# EAGLE design wifi-leds (EAGLE 9.3.1)

## Sheet 1 of 5
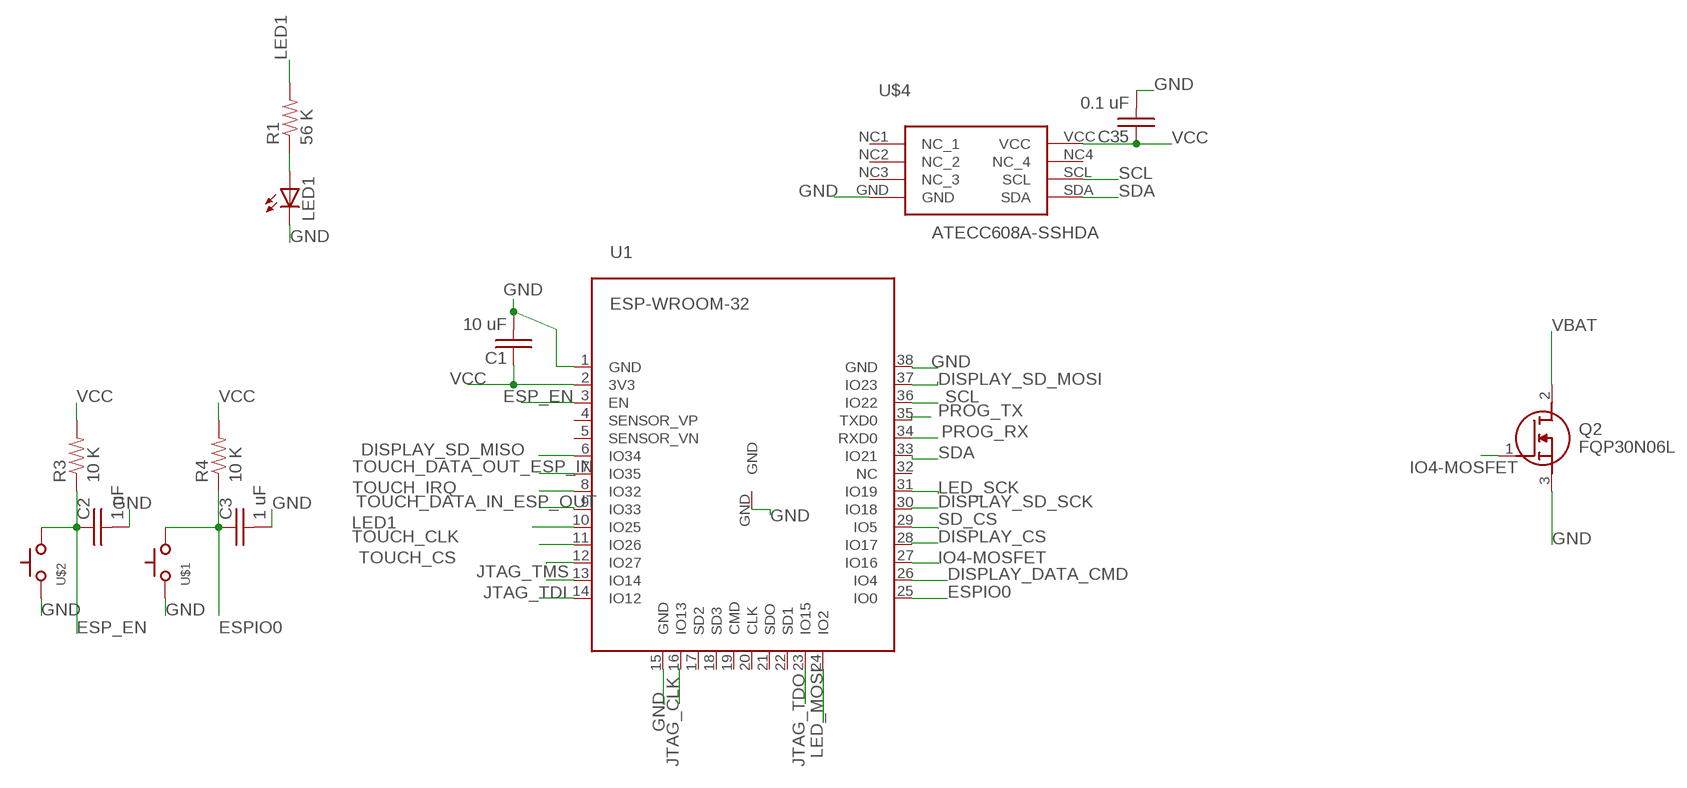
[diagram p0: schematic, sheet 1]

### Parts
C1  10 uF  C-USC0805  [C0805]
C2  1 uF  C-USC0805  [C0805]
C3  1 uF  C-USC0805  [C0805]
C35  0.1 uF  C-USC0805  [C0805]
LED1  LED3MM  [LED3MM]
Q2  FQP30N06L  [TO254P470X1016X2019-3P]
R1  56 K  RESISTOR0805-RES  [0805]
R3  10 K  RESISTOR0805-RES  [0805]
R4  10 K  RESISTOR0805-RES  [0805]
U1  ESP-WROOM-32  [ESP-WROOM-32]
U$1  SWITCH_TACTILETACTILE-2PIN-NARROW  [TACTILE-2PIN-NARROW]
U$2  SWITCH_TACTILETACTILE-2PIN-NARROW  [TACTILE-2PIN-NARROW]
U$4  ATECC608A-SSHDA  [8-SOIC]

### Nets
DISPLAY_CS: U1.28(IO17) ; also sheet 4
DISPLAY_DATA_CMD: U1.26(IO4) ; also sheet 4
DISPLAY_SD_MISO: U1.6(IO34) ; also sheet 4
DISPLAY_SD_MOSI: U1.37(IO23) ; also sheet 4
DISPLAY_SD_SCK: U1.30(IO18) ; also sheet 4
ESP_EN: C2.1 R3.1 U1.3(EN) U$2.P$1(A)
ESPIO0: C3.1 R4.1 U1.25(IO0) U$1.P$1(A)
GND: C1.2 C2.2 C3.2 C35.2 LED1.K(C) Q2.3(S) U1.1(GND) U1.15(GND) U1.38(GND) U1.GND U$1.P$2(C) U$2.P$2(C) U$4.GND ; also sheet 2,3,4
IO4-MOSFET: Q2.1(G) U1.27(IO16)
JTAG_CLK: U1.16(IO13) ; also sheet 2
JTAG_TDI: U1.14(IO12) ; also sheet 2
JTAG_TDO: U1.23(IO15) ; also sheet 2
JTAG_TMS: U1.13(IO14) ; also sheet 2
LED1: R1.2 U1.10(IO25)
LED_MOSI: U1.24(IO2) ; also sheet 2
LED_SCK: U1.31(IO19) ; also sheet 2
N$1: LED1.A R1.1
PROG_RX: U1.34(RXD0) ; also sheet 2
PROG_TX: U1.35(TXD0) ; also sheet 2
SCL: U1.36(IO22) U$4.SCL ; also sheet 2
SD_CS: U1.29(IO5) ; also sheet 4
SDA: U1.33(IO21) U$4.SDA ; also sheet 2
TOUCH_CLK: U1.11(IO26) ; also sheet 4
TOUCH_CS: U1.12(IO27) ; also sheet 4
TOUCH_DATA_IN_ESP_OUT: U1.9(IO33) ; also sheet 4
TOUCH_DATA_OUT_ESP_IN: U1.7(IO35) ; also sheet 4
TOUCH_IRQ: U1.8(IO32) ; also sheet 4
VBAT [5v]: Q2.2(D) ; also sheet 2,3
VCC: C1.1 C35.1 R3.2 R4.2 U1.2(3V3) U$4.VCC ; also sheet 2,3,4
Unconnected: U1.4(SENSOR_VP) U1.5(SENSOR_VN) U1.17(SD2) U1.18(SD3) U1.19(CMD) U1.20(CLK) U1.21(SDO) U1.22(SD1) U1.32(NC) U$4.NC1(NC_1) U$4.NC2(NC_2) U$4.NC3(NC_3) U$4.NC4(NC_4)

## Sheet 2 of 5
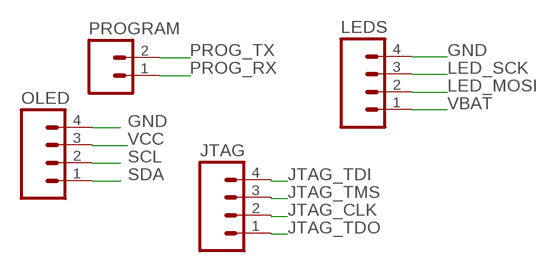
[diagram p1: schematic, sheet 2]

### Parts
JTAG  M04PTH  [1X04]
LEDS  M04POLAR  [MOLEX-1X4]
OLED  M04PTH  [1X04]
PROGRAM  M02PTH  [1X02]

### Nets
GND: LEDS.4 OLED.4 ; also sheet 1,3,4
JTAG_CLK: JTAG.2 ; also sheet 1
JTAG_TDI: JTAG.4 ; also sheet 1
JTAG_TDO: JTAG.1 ; also sheet 1
JTAG_TMS: JTAG.3 ; also sheet 1
LED_MOSI: LEDS.2 ; also sheet 1
LED_SCK: LEDS.3 ; also sheet 1
PROG_RX: PROGRAM.1 ; also sheet 1
PROG_TX: PROGRAM.2 ; also sheet 1
SCL: OLED.2 ; also sheet 1
SDA: OLED.1 ; also sheet 1
VBAT [5v]: LEDS.1 ; also sheet 1,3
VCC: OLED.3 ; also sheet 1,3,4

## Sheet 3 of 5
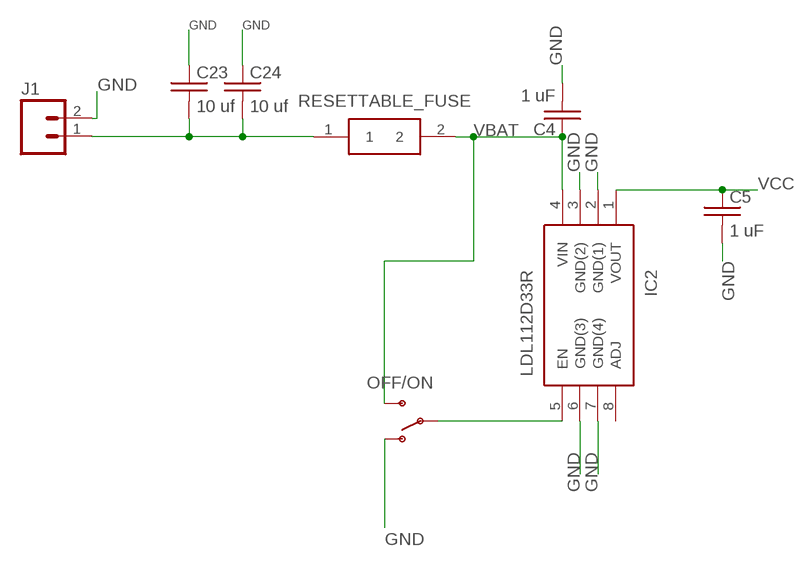
[diagram p2: schematic, sheet 3]

### Parts
C4  1 uF  C-USC0805  [C0805]
C5  1 uF  C-USC0805  [C0805]
C23  10 uf  C-USC0805  [C0805]
C24  10 uf  C-USC0805  [C0805]
IC2  LDL112D33R  [SOIC127P600X175-8N]
J1  M02PTH  [1X02]
OFF/ON  SWITCH-SPSTKIT  [SWITCH-SPDT_KIT]
RESETTABLE_FUSE  0ZCJ0050FF2G  [FUSC3216X55N]

### Nets
GND: C4.2 C5.2 C23.1 C24.1 IC2.2(GND(1)) IC2.3(GND(2)) IC2.6(GND(3)) IC2.7(GND(4)) J1.2 OFF/ON.1(O) ; also sheet 1,2,4
N$2: IC2.5(EN) OFF/ON.2(P)
N$10: C23.2 C24.2 J1.1 RESETTABLE_FUSE.1
VBAT [5v]: C4.1 IC2.4(VIN) OFF/ON.3(S) RESETTABLE_FUSE.2 ; also sheet 1,2
VCC: C5.1 IC2.1(VOUT) ; also sheet 1,2,4
Unconnected: IC2.8(ADJ)

## Sheet 4 of 5
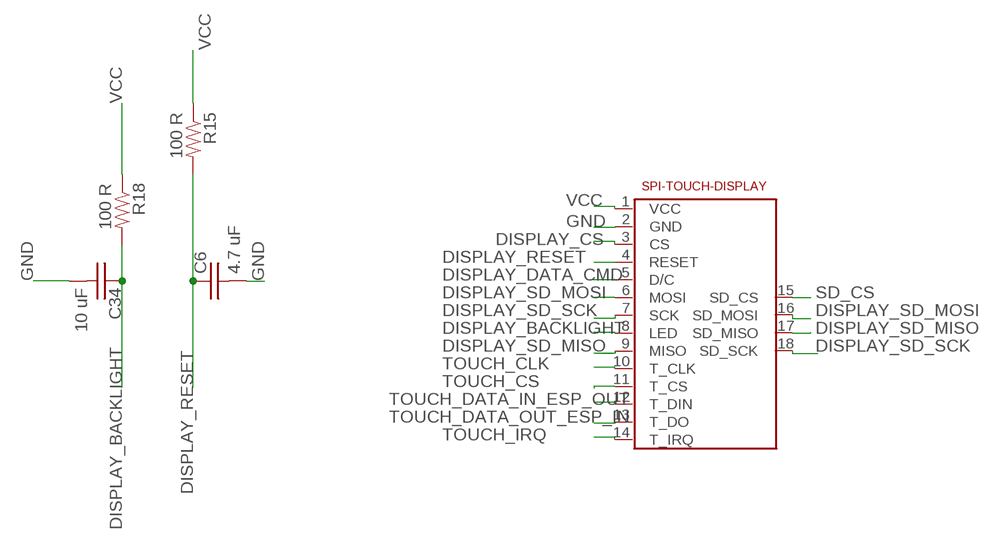
[diagram p3: schematic, sheet 4]

### Parts
C6  4.7 uF  C-USC0805  [C0805]
C34  10 uF  C-USC0805  [C0805]
R15  100 R  RESISTOR0805-RES  [0805]
R18  100 R  RESISTOR0805-RES  [0805]
U$3  2.4-SPI-TFT-TOUCH-SSD-MODULE  [2.4-SPI-TFT-TOUCH-SSD-MODULE]

### Nets
DISPLAY_BACKLIGHT: C34.1 R18.2 U$3.8(LED)
DISPLAY_CS: U$3.3(CS) ; also sheet 1
DISPLAY_DATA_CMD: U$3.5(D/C) ; also sheet 1
DISPLAY_RESET: C6.1 R15.2 U$3.4(RESET)
DISPLAY_SD_MISO: U$3.9(MISO) U$3.17(SD_MISO) ; also sheet 1
DISPLAY_SD_MOSI: U$3.6(MOSI) U$3.16(SD_MOSI) ; also sheet 1
DISPLAY_SD_SCK: U$3.7(SCK) U$3.18(SD_SCK) ; also sheet 1
GND: C6.2 C34.2 U$3.2(GND) ; also sheet 1,2,3
SD_CS: U$3.15(SD_CS) ; also sheet 1
TOUCH_CLK: U$3.10(T_CLK) ; also sheet 1
TOUCH_CS: U$3.11(T_CS) ; also sheet 1
TOUCH_DATA_IN_ESP_OUT: U$3.12(T_DIN) ; also sheet 1
TOUCH_DATA_OUT_ESP_IN: U$3.13(T_DO) ; also sheet 1
TOUCH_IRQ: U$3.14(T_IRQ) ; also sheet 1
VCC: R15.1 R18.1 U$3.1(VCC) ; also sheet 1,2,3

## Sheet 5 of 5
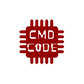
[diagram p4: schematic, sheet 5]

### Parts
U$5  CMD_C0DE_LOGOCMD_CODE_LOGO_TOP_COPPER  [CMD_C0DE_LOGO_TOP_COPPER]

## Library data of the parts
C1-C6 C23 C24 C34 C35 = passives:C-US: CAPACITOR, American symbol
IC2 = voltage-regulator:LDL112D33R: LDO Voltage Regulators 1.2 A low quiescent current LDO with reverse current protection Source: Datasheet <https://www.arrow.com/en/products/ldl112d33r/stmicroelectronics>; ARROW_PART_NUMBER: LDL112D33R; ARROW_PRICE/STOCK: https://www.arrow.com/en/products/ldl112d33r/stmicroelectronics; DESCRIPTION: LDO Voltage Regulators 1.2 A low quiescent current LDO with reverse current protection; HEIGHT: 1.75mm; MANUFACTURER_NAME: STMicroelectronics; MANUFACTURER_PART_NUMBER: LDL112D33R
J1 PROGRAM = connector:M02: Standard 2-pin 0.1" header. Use with - straight break away headers ( PRT-00116) - right angle break away headers (PRT-00553) - swiss pins (PRT-00743) - machine pins (PRT-00117) - female headers (PRT-00115) Molex polarized connector foot print use with: PRT-08233 with associated crimp pins and housings. 2.54_SCREWTERM for use with PRT-10571. 3.5mm Screw Terminal footprints for PRT-08084 5mm Screw Terminal footprints for use with PRT-08432
JTAG OLED = connector:M04: Header 4 Standard 4-pin 0.1" header. Use with straight break away headers (SKU : PRT-00116), right angle break away headers (PRT-00553), swiss pins (PRT-00743), machine pins (PRT-00117), and female headers (PRT-00115). Molex polarized connector foot print use with SKU : PRT-08231 with associated crimp pins and housings. 1MM SMD Version SKU: PRT-10208; PROD_ID: CONN-09696
LED1 = leds:LED: LEDs Standard schematic elements and footprints for 5mm, 3mm, 1206, and 0603 sized LEDs. 5mm - Spark Fun Electronics SKU : COM-00529 (and others)
LEDS = connector:M04: Header 4 Standard 4-pin 0.1" header. Use with straight break away headers (SKU : PRT-00116), right angle break away headers (PRT-00553), swiss pins (PRT-00743), machine pins (PRT-00117), and female headers (PRT-00115). Molex polarized connector foot print use with SKU : PRT-08231 with associated crimp pins and housings. 1MM SMD Version SKU: PRT-10208
OFF/ON = switches:SWITCH-SPST: SPST Switch Simple slide switch.
Q2 = transitors:FQP30N06L: FQP30N06L N-Channel MOSFET, 32 A, 60 V QFET, 3-Pin TO-220 ON Semiconductor Source: Datasheet <https://www.mouser.com/datasheet/2/308/FQP30N06L-1306227.pdf>; DESCRIPTION: FQP30N06L N-Channel MOSFET, 32 A, 60 V QFET, 3-Pin TO-220 ON Semiconductor; HEIGHT: 4.7mm; MANUFACTURER_NAME: ON Semiconductor; MANUFACTURER_PART_NUMBER: FQP30N06L; MOUSER_PART_NUMBER: 512-FQP30N06L; RS_PART_NUMBER: 8075863P; RS_PRICE-STOCK: http://uk.rs-online.com/web/p/products/8075863P
R1 R3 R4 = passives:RESISTOR: Resistor Basic schematic elements and footprints for 0603, 1206, and PTH resistors.
R15 R18 = dc-26:RESISTOR: Resistor Basic schematic elements and footprints for 0603, 1206, and PTH resistors.
RESETTABLE_FUSE = passives:0ZCJ0050FF2G: Resettable Fuses - PPTC <https://componentsearchengine.com/Images/9/0ZCJ0050FF2G.jpg> Source: Datasheet <https://www.belfuse.com/resources/CircuitProtection/datasheets/0ZCJ Nov2016.pdf>; DESCRIPTION: Resettable Fuses - PPTC; HEIGHT: 0.55mm; MANUFACTURER_NAME: Bel-Stewart; MANUFACTURER_PART_NUMBER: 0ZCJ0050FF2G; SUPPLIER_NAME: RS
U1 = ICs:ESP-WROOM-32
U$1 U$2 = switches:SWITCH_TACTILE
U$3 = displays:2.4-SPI-TFT-TOUCH-SSD-MODULE: 2.4" SPI TFT Module Driver: ILI9341 DOTS: 240x320 Touch: YES
U$4 = ICs:ATECC608A-SSHDA
U$5 = logos:CMD_C0DE_LOGO

## Net classes
2 5v: width 0.254 mm, drill 0.8 mm, clearance 0.178 mm

## Board
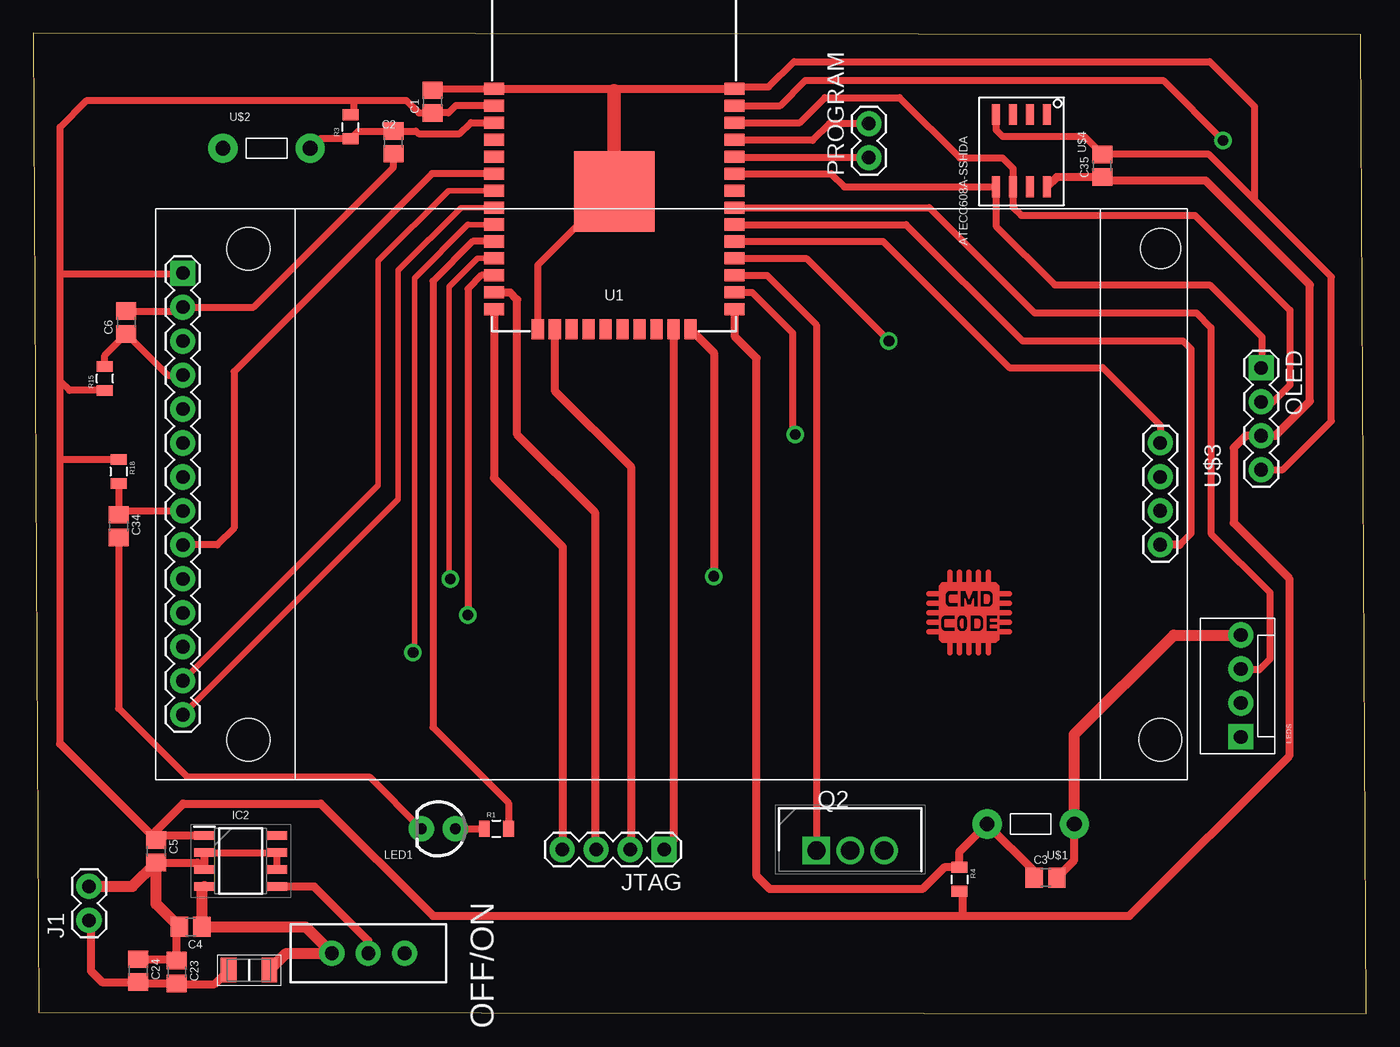
[diagram p5: board, top side]
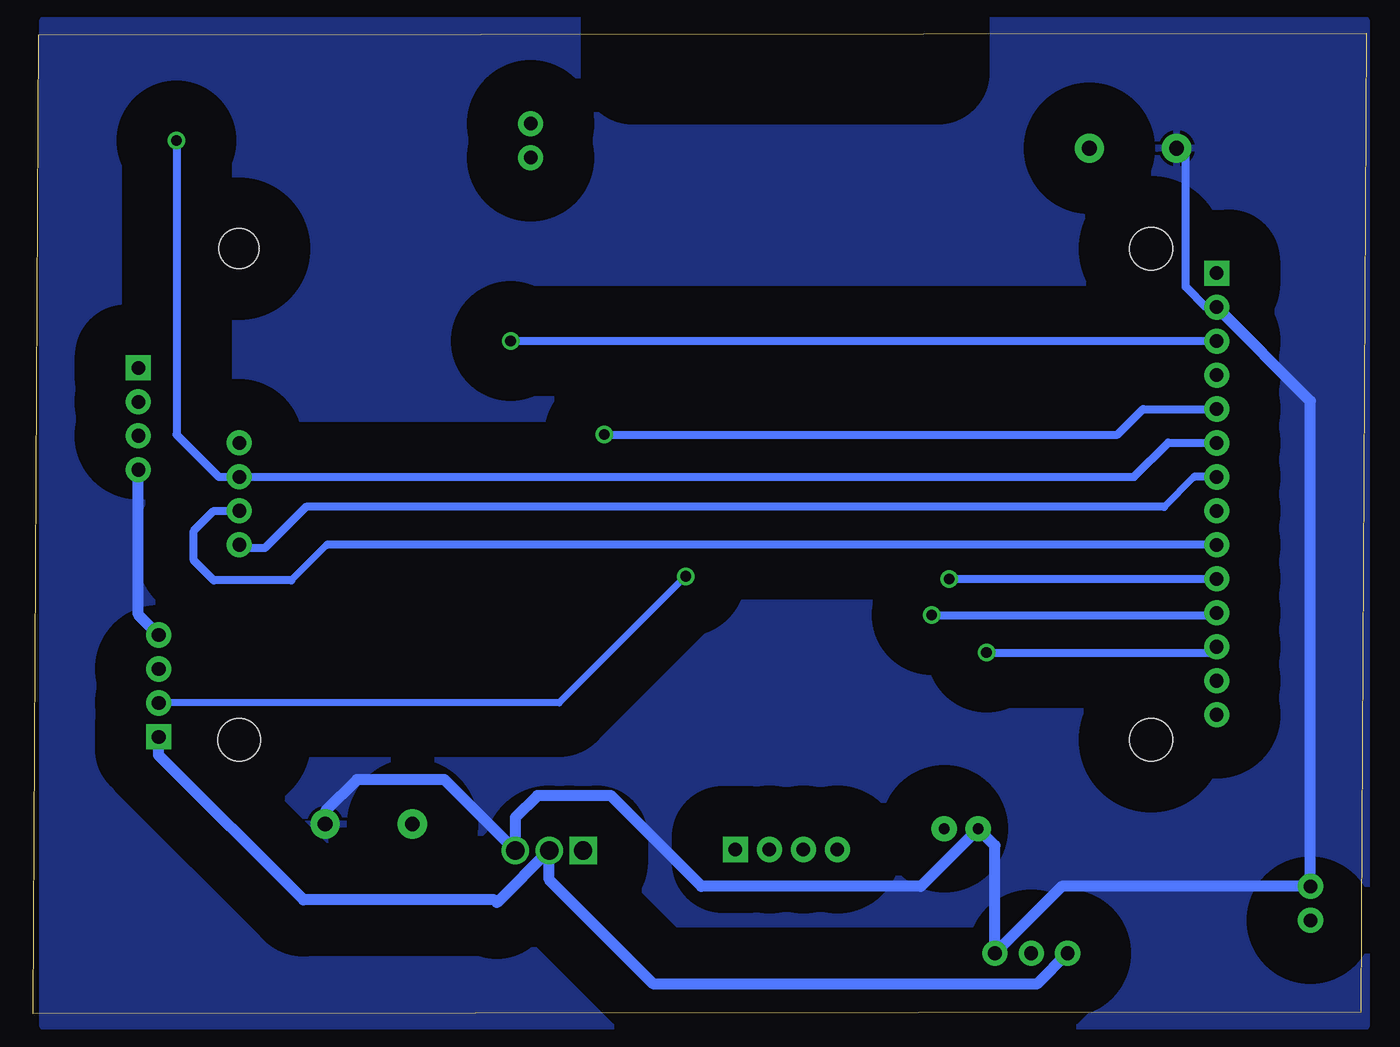
[diagram p6: board, bottom side, seen from below]

Size 99.7 x 73.3 mm. Coordinates in mm from the lower left corner, seen from the top.
Outline: 0.4,0.1 99.7,0 99.3,73.2 0,73.3 0.4,0.1
Copper layers (1*16): Top 0.035mm / dielectric 1.5mm / Bottom 0.035mm
Design rules "OthermillDRC_1_100_v2-cmd0de *": minimum track width 10mil, minimum drill 0.8mm, track to track 0.2797mm, track to pad 0.2797mm, pad to pad 0.256540625mm, via to via 0.256540625mm, smd to smd 0mil, copper to edge 0mil, drill to drill 1mil, minimum pad ring 10mil, minimum via ring 10mil, stop-mask expansion 1mil, vias tented up to drill 30mil, thermal gap 10mil

### Footprints (pad centres in the part's own frame; a part is rotated, then mirrored left to right if it is on the bottom)
C0805 = smd 1.3 x 1.5: 1 -0.85,0; 2 0.85,0
SOIC127P600X175-8N = smd 1.525 x 0.65: 1 -2.712,1.905; 2 -2.712,0.635; 3 -2.712,-0.635; 4 -2.712,-1.905; 5 2.712,-1.905; 6 2.712,-0.635; 7 2.712,0.635; 8 2.712,1.905
1X02 = drill 1.016 pad 1.88: 1 0,0; 2 2.54,0
1X04 = drill 1.016 pad 1.88 square: 1 0,0 | drill 1.016 pad 1.88: 2 2.54,0; 3 5.08,0; 4 7.62,0
LED3MM = drill 0.813 pad 1.88: A -1.27,0; K 1.27,0
MOLEX-1X4 = drill 1.016 pad 1.88 square: 1 0,0 | drill 1.016 pad 1.88: 2 2.54,0; 3 5.08,0; 4 7.62,0
SWITCH-SPDT_KIT = drill 1.016 pad 1.88: 1 0,2.718; 2 0,0; 3 0,-2.718
TO254P470X1016X2019-3P = drill 1.37 pad 2.055 square: 1 0,0 | drill 1.37 pad 2.055: 2 2.535,0; 3 5.07,0
0805 = smd 0.8 x 1.2: 1 -0.9,0; 2 0.9,0
FUSC3216X55N = smd 1.17 x 1.82: 1 -1.52,0; 2 1.52,0
ESP-WROOM-32 = smd 0.9 x 1.5: 1 7.7,9; 2 6.43,9; 3 5.16,9; 4 3.89,9; 5 2.62,9; 6 1.35,9; 7 0.08,9; 8 -1.19,9; 9 -2.46,9; 10 -3.73,9; 11 -5,9; 12 -6.27,9; 13 -7.54,9; 14 -8.81,9; 25 -8.81,-9; 26 -7.54,-9; 27 -6.27,-9; 28 -5,-9; 29 -3.73,-9; 30 -2.46,-9; 31 -1.19,-9; 32 0.08,-9; 33 1.35,-9; 34 2.62,-9; 35 3.89,-9; 36 5.16,-9; 37 6.43,-9; 38 7.7,-9 | smd 1.5 x 0.9: 15 -10.3,5.715; 16 -10.3,4.445; 17 -10.3,3.175; 18 -10.3,1.905; 19 -10.3,0.635; 20 -10.3,-0.635; 21 -10.3,-1.905; 22 -10.3,-3.175; 23 -10.3,-4.445; 24 -10.3,-5.715 | smd 6 x 6: GND 0,0
TACTILE-2PIN-NARROW = drill 1.1 pad 2.184: P$1 3.264,0; P$2 -3.264,0
2.4-SPI-TFT-TOUCH-SSD-MODULE = drill 1.016 pad 1.88 square: 1 4.83,2.02 | drill 1.016 pad 1.88: 2 7.37,2.02; 3 9.91,2.02; 4 12.45,2.02; 5 14.99,2.02; 6 17.53,2.02; 7 20.07,2.02; 8 22.61,2.02; 9 25.15,2.02; 10 27.69,2.02; 11 30.23,2.02; 12 32.77,2.02; 13 35.31,2.02; 14 37.85,2.02; 15 17.52,75.14; 16 20.06,75.14; 17 22.6,75.14; 18 25.14,75.14 | hole 3: 3,75.16 | hole 3.2: 39.72,75.16; 39.72,6.92; 3,6.92
8-SOIC = smd 0.6 x 1.55: GND 3.81,0; NC1 0,0; NC2 1.27,0; NC3 2.54,0; NC4 1.27,5.4; SCL 2.54,5.4; SDA 3.81,5.4; VCC 0,5.4

### Placement (x,y rotation side)
C1  29.86,68.2 90 top
C2  26.94,65.15 270 top
C3  75.72,10.17 0 top
C4  11.76,6.48 180 top
C5  9.18,12.14 270 top
C6  6.95,51.68 90 top
C23  10.73,3.11 270 top
C24  7.84,3.21 270 top
C34  6.38,36.45 270 top
C35  79.96,63.4 90 top
IC2  15.51,11.4 0 top
J1  4.16,6.97 90 top
JTAG  47.18,12.27 180 top
LED1  30.29,13.82 180 top
LEDS  90.33,20.69 90 top
OFF/ON  25.05,4.51 270 top
OLED  91.85,48.29 270 top
PROGRAM  62.5,64.01 90 top
Q2  58.58,12.2 0 top
R1  34.64,13.82 0 top
R3  23.73,66.32 90 top
R4  69.28,10.04 270 top
R15  5.35,47.5 90 top
R18  6.38,40.53 270 top
RESETTABLE_FUSE  16.13,3.25 0 top
U1  43.45,61.47 90 top
U$1  74.61,14.17 180 top
U$2  17.44,64.71 0 top
U$3  9.16,60.2 270 top
U$4  75.83,67.23 180 top
U$5  70,30.3 0 top

### Tracks (layer width: path | path; a pad name or v marks a point on that pad's centre or on a via)
DISPLAY_BACKLIGHT
  Top 0.508: R18.2 C34.1 6.67,37.59 U$3.8
DISPLAY_CS  (via drill 0.8)
  Top 0.508: U1.28 57.83,56.47 v64,50.3
  Bottom 0.254: U$3.3
  Bottom 0.61: v64,50.3 U$3.3
DISPLAY_DATA_CMD  (via drill 0.8)
  Top 0.254: 56.8,43.5 v57,43.3
  Top 0.508: U1.26 53.77,53.93 56.8,50.9 56.8,43.5
  Bottom 0.61: v57,43.3 18.6,43.3 16.69,45.21 U$3.5
DISPLAY_RESET
  Top 0.508: R15.2 5.35,49.23 C6.1 10.03,47.75 U$3.4
DISPLAY_SD_MISO
  Top 0.508: U1.6 29.82,62.82 15,48 15,36.3 13.75,35.05 U$3.9
  Bottom 0.508: 77.75,35.05 80.4,32.4
  Bottom 0.61: U$3.9 77.75,35.05 | 80.4,32.4 86.2,32.4 87.7,33.9 87.7,36.1 86.2,37.6 U$3.17
DISPLAY_SD_MOSI  (via drill 0.8)
  Top 0.508: U1.37 55.87,67.9 57.76,69.78 84.52,69.78 v89,65.3
  Bottom 0.254: U$3.16 84,40.14 | 11.21,42.7 U$3.6
  Bottom 0.61: 11.21,42.7 14.8,42.7 17.36,40.14 84,40.14 85.84,40.14 89,43.3 v89,65.3
DISPLAY_SD_SCK
  Top 0.508: U1.30 65.29,59.01 74,50.3 86,50.3 86.6,49.7 86.6,35.9 85.76,35.06
  Top 0.61: 85.76,35.06 U$3.18
  Bottom 0.254: 84.04,34.8 U$3.18
  Bottom 0.508: 15.11,37.9 12.88,40.13
  Bottom 0.61: U$3.7 12.88,40.13 | 84.04,34.8 82.4,34.8 79.3,37.9 15.11,37.9
ESP_EN
  Top 0.508: U$2.P$1 21.41,65.42 R3.1 24.31,66 C2.1 28.6,66 28.8,65.8 31.9,65.8 32.73,66.63 U1.3
ESPIO0
  Top 0.61: U1.25 52.45,50.66 54.1,49.01 54.1,10.3 55.1,9.3 66.5,9.3 68.14,10.94 R4.1 69.28,12.1 U$1.P$1 74.87,10.65 C3.1
GND
  Top 0.305: U1.38 52.58,69.3 | U1.GND 43.45,61.7 | 43.45,69.02 43.3,69.17 | C1.2 29.98,69.17 | 10.88,52.53 U$3.2
  Top 0.508: IC2.2 IC2.7 IC2.6 | U$4.GND 72.02,66.08 72.5,65.6 78.61,65.6 C35.2 87.95,64.25 91.35,60.85 | 52.58,69.3 55,69.3 56.9,71.2 88,71.2 91.35,67.85 91.35,60.85 | U1.15 37.73,55.98 43.45,61.7 | 29.98,69.17 U1.1 | U$3.2 16.47,52.83 26.94,63.3 C2.2 | C6.2 10.88,52.53 | C34.2 6.38,22.82 11.5,17.7 25.14,17.7 LED1.K | OLED.4 93.47,40.67 97.1,44.3 97.1,55.1 91.35,60.85
  Top 0.61: U1.1 43.3,69.17 U1.38 | C5.2 12.27,11.29 IC2.3 IC2.2 | U$1.P$2 77.87,11.47 C3.2 | C24.1 10.63,4.06 C23.1 10.73,6.3 C4.2
  Top 0.813: J1.2 7.4,9.51 C5.2 9.18,8.21 C4.2 | U$1.P$2 77.87,20.87 85.31,28.31 LEDS.4
  Top 1.016: 43.45,61.7 43.45,69.02
  Bottom 0.61: U$3.2 11.98,52.83 13.5,54.35 13.5,64.03 U$2.P$2
  Bottom 0.813: U$3.2 4.16,45.81 J1.2 22.77,9.51 OFF/ON.1 27.77,12.57 LED1.K 33.32,9.52 49.72,9.52 56.5,16.3 62,16.3 63.65,14.65 Q2.3 68.95,17.5 75.5,17.5 77.87,15.13 U$1.P$2 | LEDS.4 91.85,29.83 OLED.4
  pour Bottom (isolate 3.81): 0,74.3 0,-0.95 99,-0.95 99,74.3
IO4-MOSFET
  Top 0.508: Q2.1 58.58,51.51 54.89,55.2 U1.27
JTAG_CLK
  Top 0.508: 44.7,12.33 JTAG.2
  Top 0.61: U1.16 39,46.6 44.7,40.9 44.7,12.33
JTAG_TDI
  Top 0.508: 39.6,12.31 JTAG.4
  Top 0.61: 39.6,12.31 39.6,34.9 34.45,40.05 U1.14
JTAG_TDO
  Top 0.61: U1.23 47.89,12.98 JTAG.1
JTAG_TMS
  Top 0.508: 42,12.37 JTAG.3
  Top 0.61: U1.13 35.67,53.93 36.2,53.4 36.2,43.3 42,37.5 42,12.37
LED1
  Top 0.305: U1.10 34.44,57.75
  Top 0.508: 34.44,57.75 32.87,57.75 29.9,54.78 29.9,21.4 35.54,15.76 R1.2
LED_MOSI  (via drill 0.8)
  Top 0.61: U1.24 50.9,49.44 v50.9,32.7
  Bottom 0.508: LEDS.2 60.37,23.23 v50.9,32.7
LED_SCK
  Top 0.305: 90.26,25.7 LEDS.3
  Top 0.508: U1.31 67.02,60.28 74.9,52.4 87,52.4 88.1,51.3 88.1,35.9 92.5,31.5 92.5,26.5 91.7,25.7 90.26,25.7
N$1
  Top 0.508: LED1.A R1.1
N$2
  Top 0.61: OFF/ON.2 25.05,5.45 21,9.49 IC2.5
N$10
  Top 0.61: J1.1 4.3,6.83 4.3,3.2 5.14,2.36 C24.2 7.94,2.26 C23.2 10.79,2.2 13.56,2.2 RESETTABLE_FUSE.1
PROG_RX
  Top 0.305: 52.53,64.01 U1.34
  Top 0.508: PROGRAM.1 52.53,64.01
PROG_TX
  Top 0.305: 52.51,65.3 U1.35
  Top 0.508: PROGRAM.2 59.55,66.55 58.3,65.3 52.51,65.3
SCL
  Top 0.508: U1.36 57.33,66.63 59.2,68.5 64.8,68.5 69.3,64 72.5,64 73.29,63.21 U$4.SCL 73.29,60.31 73.9,59.7 86.9,59.7 94,52.6 94,47 92.75,45.75 OLED.2
SD_CS
  Top 0.508: U1.29 63.56,57.74 73,48.3 80,48.3 84.3,44 U$3.15
SDA
  Top 0.508: U1.33 59.68,62.82 60.67,61.83 U$4.SDA 72.02,58.88 76.4,54.5 88,54.5 91.9,50.6 91.9,48.34 OLED.1
TOUCH_CLK  (via drill 0.8)
  Top 0.305: U1.11 34.44,56.48 | 31.1,32.6 v31.2,32.5
  Top 0.406: 34.44,56.48 33.22,56.48 31.1,54.36 31.1,32.6
  Bottom 0.305: U$3.10
  Bottom 0.61: v31.2,32.5 U$3.10
TOUCH_CS  (via drill 0.8)
  Top 0.508: U1.12 33.5,55.2 32.5,54.2 v32.5,29.8
  Bottom 0.254: 11.35,29.8 U$3.11
  Bottom 0.61: v32.5,29.8 11.35,29.8
TOUCH_DATA_IN_ESP_OUT  (via drill 0.8)
  Top 0.305: 28.5,27.2 28.4,27.1 v28.4,27
  Top 0.406: 28.5,27.2 28.5,55 32.52,59.02 32.53,59.01 U1.9
  Bottom 0.406: 11.61,27 U$3.12
  Bottom 0.61: v28.4,27 11.61,27
TOUCH_DATA_OUT_ESP_IN
  Top 0.406: U1.7 31.05,61.55 25.8,56.3 25.8,39.51 U$3.13
TOUCH_IRQ
  Top 0.406: U$3.14 27.3,38.47 27.3,55.57 32.01,60.28 U1.8
VBAT
  Top 0.813: RESETTABLE_FUSE.2 18.91,4.51 OFF/ON.3 20.36,6.48 C4.1 12.61,9.31 IC2.4
  Bottom 0.813: LEDS.1 90.33,19.33 79.5,8.5 65.22,8.5 65.02,8.3 Q2.2 61.11,10.01 53.3,2.2 24.64,2.2 OFF/ON.3
VCC
  Top 0.508: 9.5,13.3 C5.1 9.18,13.69 | 2,20.17 2,41.3 | 2,41.3 2,47.3 | 2,47.3 2,55.3 | 2,55.3 2,66.3 4,68.3 24,68.3 | 24,68.3 27.9,68.3 28.85,67.35 C1.1 31.05,67.35 31.6,67.9 U1.2 | R3.2 24,67.49 24,68.3 | U$3.1 11.11,55.3 2,55.3 | R15.1 2.7,46.6 2,47.3 | 80.21,62.3 C35.1 | R18.1 2.13,41.43 2,41.3
  Top 0.61: IC2.1 9.5,13.3 | C5.1 2,20.17 | 80.21,62.3 87.7,62.3 95.5,54.5 95.5,45.8 92.91,43.21 OLED.3 90.71,43.21 89.8,42.3 89.8,36.7 93.95,32.55 93.95,19.25 82,7.3 69.5,7.3 | C35.1 76.55,62.55 U$4.VCC | 9.18,13.69 11.19,15.7 21.5,15.7 29.9,7.3 69.5,7.3 | R4.2 69.5,8.92 69.5,7.3